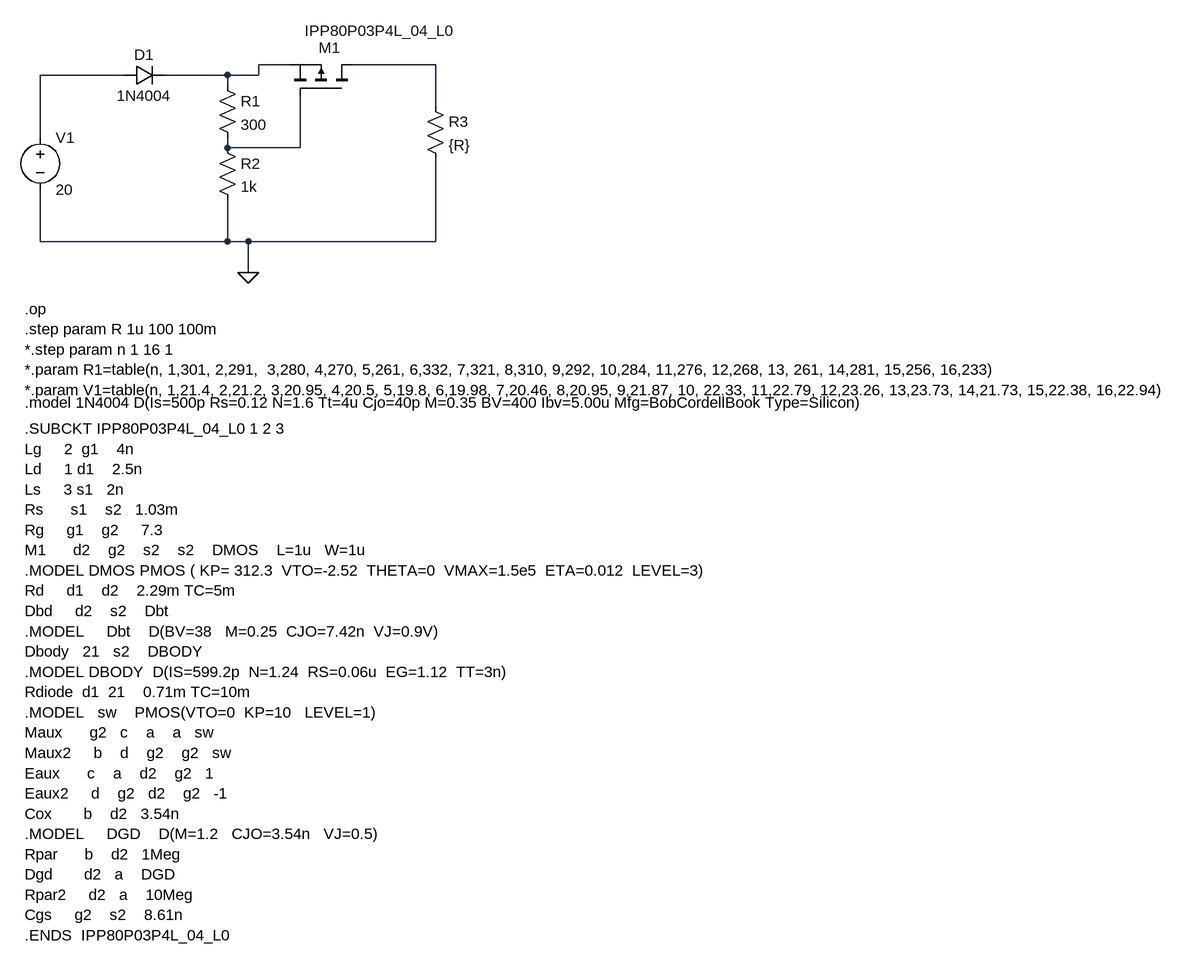
[diagram p0: schematic Solar Emulator.asc]
Solar Emulator.asc, the LTspice schematic file:
Version 4
SHEET 1 1848 2180
WIRE 368 160 320 160
WIRE 592 160 464 160
WIRE 112 176 -16 176
WIRE 272 176 176 176
WIRE 320 176 320 160
WIRE 320 176 272 176
WIRE 272 192 272 176
WIRE 592 224 592 160
WIRE -16 272 -16 176
WIRE 272 288 272 272
WIRE 384 288 384 208
WIRE 384 288 272 288
WIRE -16 432 -16 352
WIRE 272 432 272 368
WIRE 272 432 -16 432
WIRE 304 432 272 432
WIRE 592 432 592 304
WIRE 592 432 304 432
WIRE 304 480 304 432
FLAG 304 480 0
SYMBOL pmos 464 208 M270
WINDOW 0 74 52 VLeft 2
WINDOW 3 100 73 VLeft 2
SYMATTR InstName M1
SYMATTR Value IPP80P03P4L_04_L0
SYMATTR Prefix X
SYMATTR SpiceModel IPP80P03P4L_04_L0
SYMBOL Diode 112 192 R270
WINDOW 0 32 32 VTop 2
WINDOW 3 0 32 VBottom 2
SYMATTR InstName D1
SYMATTR Value 1N4004
SYMBOL Res 256 176 R0
SYMATTR InstName R1
SYMATTR Value 300
SYMBOL Voltage -16 256 R0
SYMATTR InstName V1
SYMATTR Value 20
SYMBOL Res 256 272 R0
SYMATTR InstName R2
SYMATTR Value 1k
SYMBOL Res 576 208 R0
SYMATTR InstName R3
SYMATTR Value {R}
TEXT -40 680 Left 2 !.model 1N4004 D(Is=500p Rs=0.12 N=1.6 Tt=4u Cjo=40p M=0.35 BV=400 Ibv=5.00u Mfg=BobCordellBook Type=Silicon)
TEXT -40 536 Left 2 !.op\n.step param R 1u 100 100m\n*.step param n 1 16 1\n*.param R1=table(n, 1,301, 2,291,  3,280, 4,270, 5,261, 6,332, 7,321, 8,310, 9,292, 10,284, 11,276, 12,268, 13, 261, 14,281, 15,256, 16,233)\n*.param V1=table(n, 1,21.4, 2,21.2, 3,20.95, 4,20.5, 5,19.8, 6,19.98, 7,20.46, 8,20.95, 9,21.87, 10, 22.33, 11,22.79, 12,23.26, 13,23.73, 14,21.73, 15,22.38, 16,22.94)
TEXT -40 720 Left 2 !.SUBCKT IPP80P03P4L_04_L0 1 2 3 \nLg     2  g1    4n\nLd     1 d1    2.5n\nLs     3 s1   2n\nRs      s1    s2   1.03m\nRg     g1    g2     7.3\nM1      d2    g2    s2    s2    DMOS    L=1u   W=1u\n.MODEL DMOS PMOS ( KP= 312.3  VTO=-2.52  THETA=0  VMAX=1.5e5  ETA=0.012  LEVEL=3)\nRd     d1    d2    2.29m TC=5m\nDbd     d2    s2    Dbt\n.MODEL     Dbt    D(BV=38   M=0.25  CJO=7.42n  VJ=0.9V)\nDbody   21   s2    DBODY\n.MODEL DBODY  D(IS=599.2p  N=1.24  RS=0.06u  EG=1.12  TT=3n)\nRdiode  d1  21    0.71m TC=10m\n.MODEL   sw    PMOS(VTO=0  KP=10   LEVEL=1)\nMaux      g2   c    a    a   sw\nMaux2     b    d    g2    g2   sw\nEaux      c    a    d2    g2   1\nEaux2     d    g2   d2    g2   -1\nCox       b    d2   3.54n\n.MODEL     DGD    D(M=1.2   CJO=3.54n   VJ=0.5)\nRpar      b    d2   1Meg\nDgd       d2   a    DGD\nRpar2     d2   a    10Meg\nCgs     g2    s2    8.61n\n.ENDS  IPP80P03P4L_04_L0

The netlist it stands for:
* Solar Emulator.asc
XM1 N002 N004 N001 IPP80P03P4L_04_L0 IPP80P03P4L_04_L0  ; pins D G S
D1 N003 N001 1N4004
R1 N001 N004 300
V1 N003 0 20
R2 N004 0 1k
R3 N002 0 {R}
.model D D
.lib standard.dio
.model 1N4004 D(Is=500p Rs=0.12 N=1.6 Tt=4u Cjo=40p M=0.35 BV=400 Ibv=5.00u Mfg=BobCordellBook Type=Silicon)
.op
.step param R 1u 100 100m
*.step param n 1 16 1
*.param R1=table(n, 1,301, 2,291,  3,280, 4,270, 5,261, 6,332, 7,321, 8,310, 9,292, 10,284, 11,276, 12,268, 13, 261, 14,281, 15,256, 16,233)
*.param V1=table(n, 1,21.4, 2,21.2, 3,20.95, 4,20.5, 5,19.8, 6,19.98, 7,20.46, 8,20.95, 9,21.87, 10, 22.33, 11,22.79, 12,23.26, 13,23.73, 14,21.73, 15,22.38, 16,22.94)
.SUBCKT IPP80P03P4L_04_L0 1 2 3
Lg     2  g1    4n
Ld     1 d1    2.5n
Ls     3 s1   2n
Rs      s1    s2   1.03m
Rg     g1    g2     7.3
M1      d2    g2    s2    s2    DMOS    L=1u   W=1u
.MODEL DMOS PMOS ( KP= 312.3  VTO=-2.52  THETA=0  VMAX=1.5e5  ETA=0.012  LEVEL=3)
Rd     d1    d2    2.29m TC=5m
Dbd     d2    s2    Dbt
.MODEL     Dbt    D(BV=38   M=0.25  CJO=7.42n  VJ=0.9V)
Dbody   21   s2    DBODY
.MODEL DBODY  D(IS=599.2p  N=1.24  RS=0.06u  EG=1.12  TT=3n)
Rdiode  d1  21    0.71m TC=10m
.MODEL   sw    PMOS(VTO=0  KP=10   LEVEL=1)
Maux      g2   c    a    a   sw
Maux2     b    d    g2    g2   sw
Eaux      c    a    d2    g2   1
Eaux2     d    g2   d2    g2   -1
Cox       b    d2   3.54n
.MODEL     DGD    D(M=1.2   CJO=3.54n   VJ=0.5)
Rpar      b    d2   1Meg
Dgd       d2   a    DGD
Rpar2     d2   a    10Meg
Cgs     g2    s2    8.61n
.ENDS  IPP80P03P4L_04_L0
.backanno
.end